# EasyEDA schematic schematic.json
TITLE: Sheet_1; REV: 1.0; Date: 2019-10-06; Sheet: 1/1; Drawn By: saikek; Company: Your Company
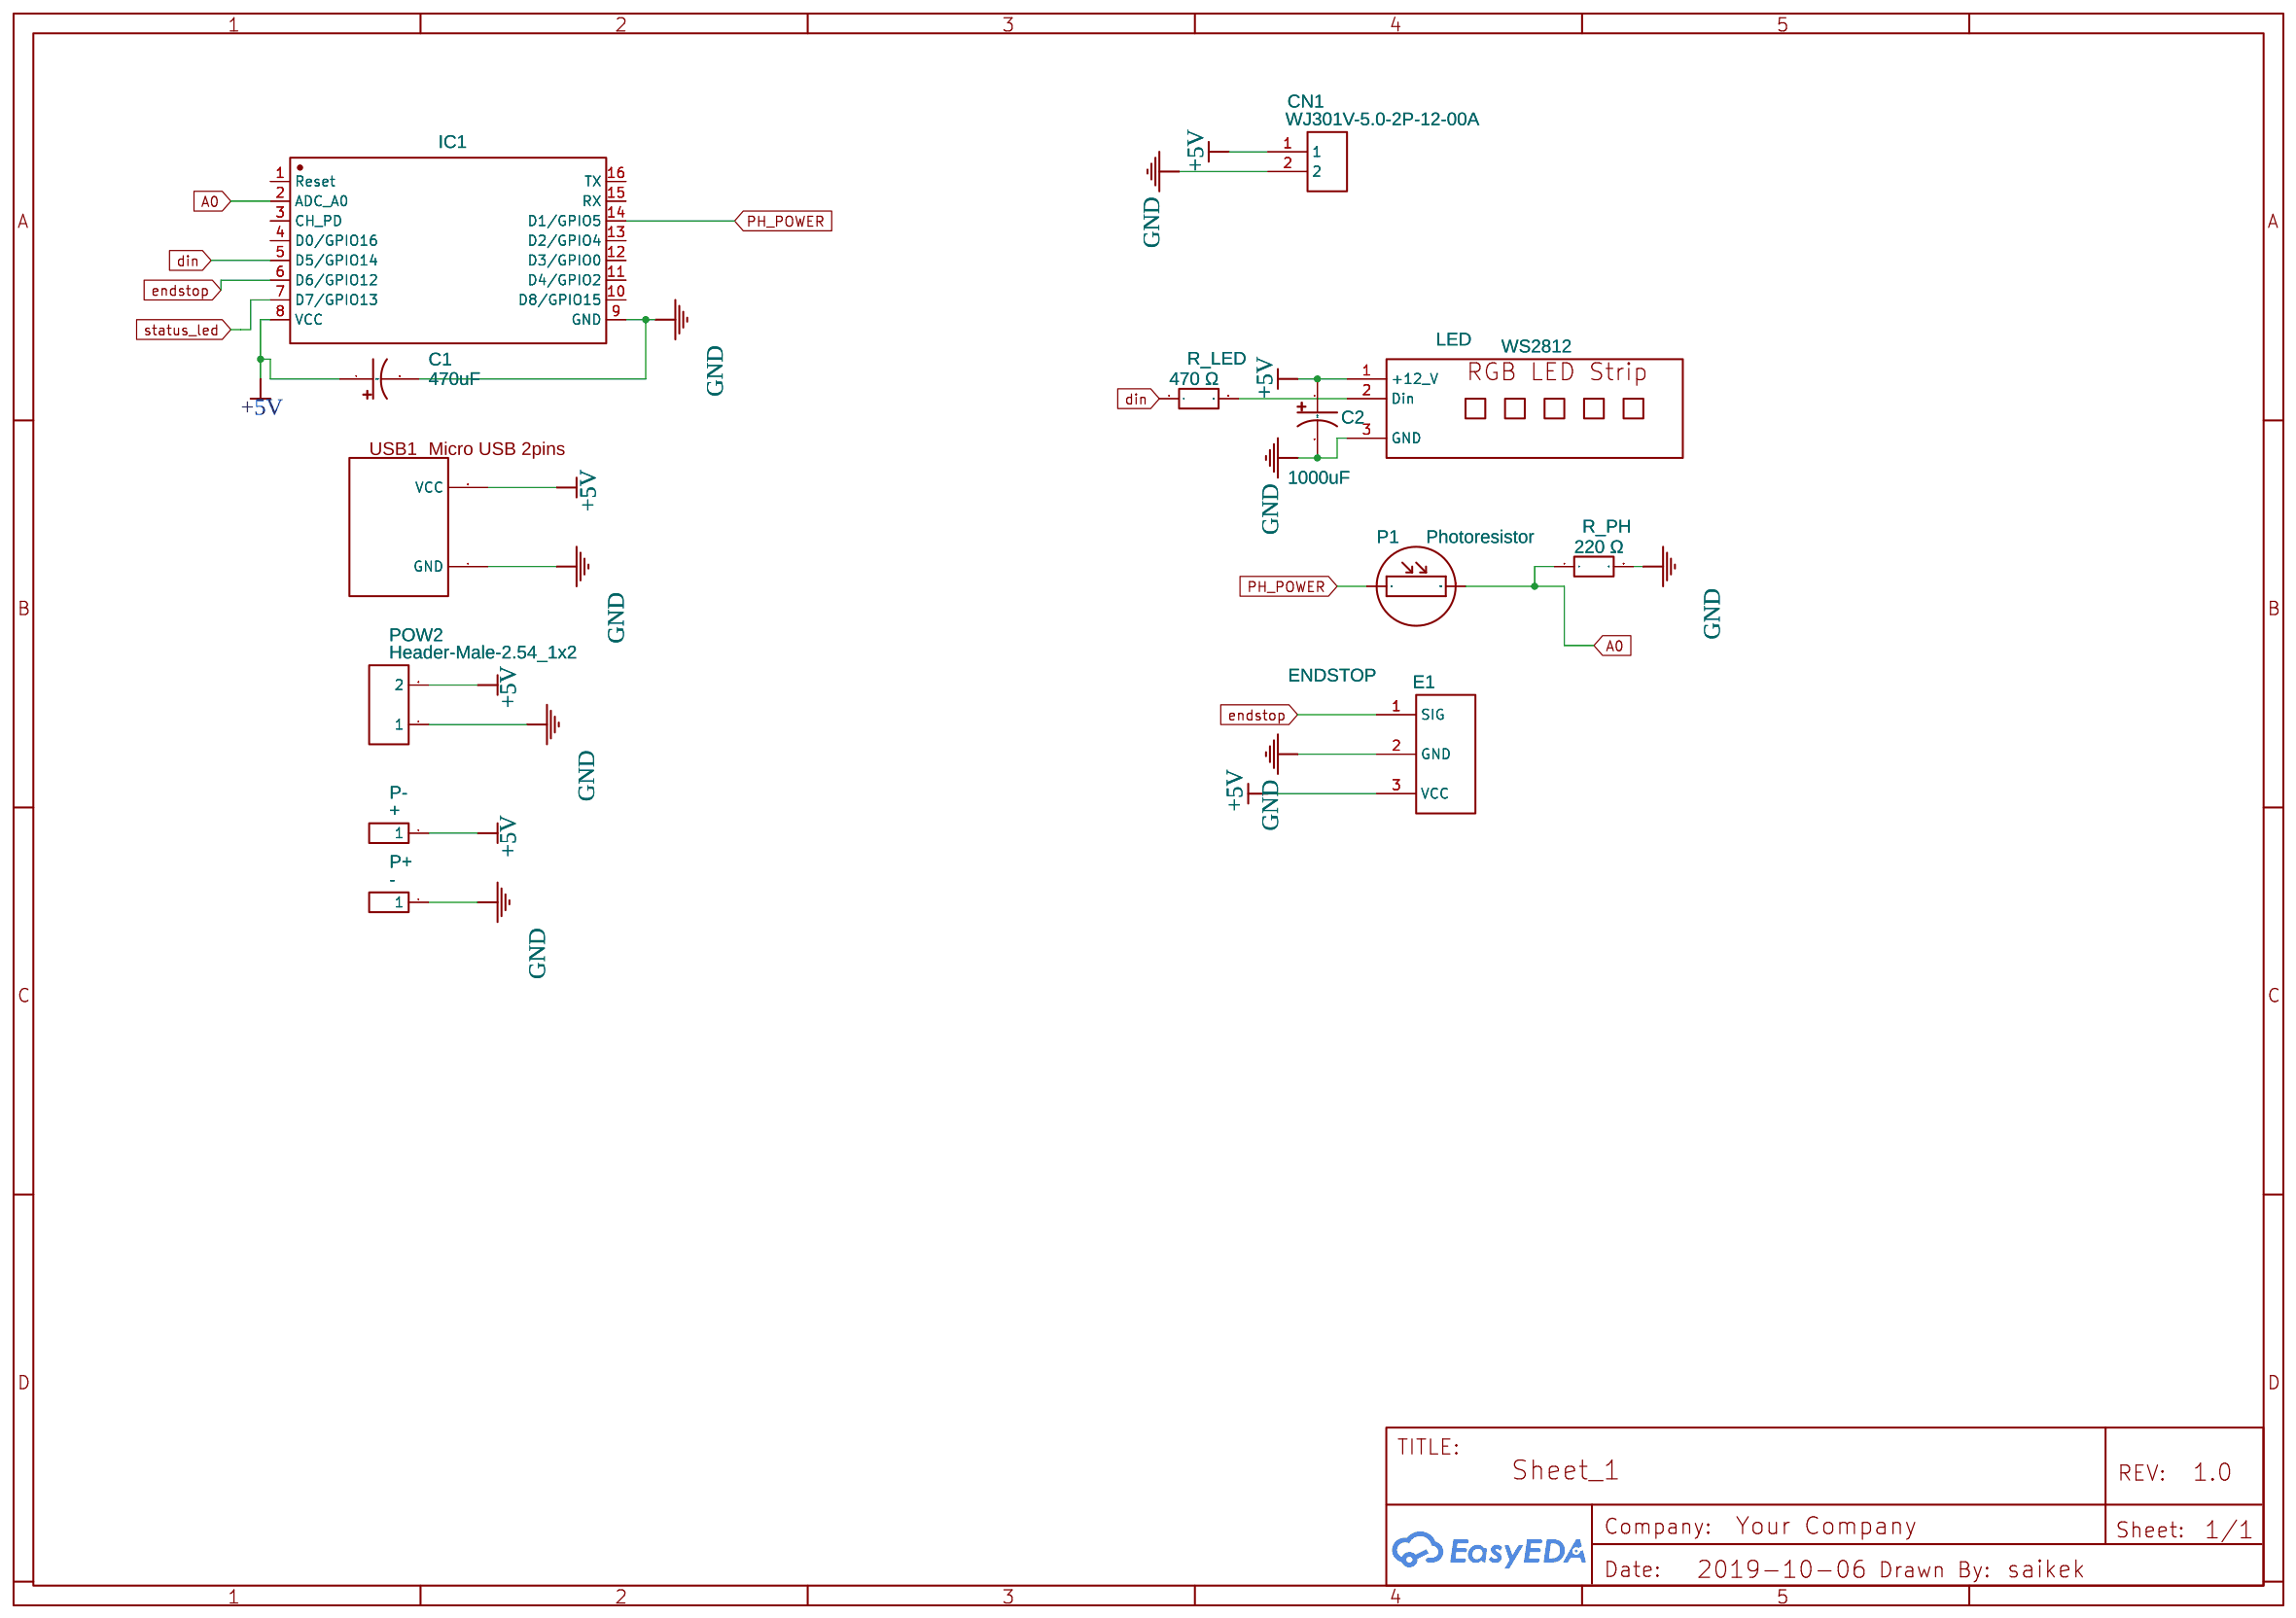
[diagram p0: schematic sheet]

## Parts
C1  470uF  [CAP-SMD_BD6.3-L6.6-W6.6-FD]
C2  1000uF  [CAP-SMD_BD8.0-L8.3-W8.3-FD]
CN1  WJ301V-5.0-2P-12-00A  [WJ301V-5.0-2P-12-00A]
ENDSTOP  E1  [ENDSTOP]
IC1  Witty  [ESP8266_WITTY_12F]
LED  WS2812  [WS2812 LED_STRIP_PADS]
P1  Photoresistor  [SNR2-3.0]
P+  -  [PAD-SMD-R150]
P-  +  [PAD-SMD-R150]
POW2  Header-Male-2.54_1x2  [HDR-2X1/2.54]
R_LED  470 Ω  [1206]
R_PH  220 Ω  [1206]
U2  MicroUSB 2 pins female  [USB 2 PIN FEMALE]

## Library data of the parts
C1 = VE-471M0JTR-0607: Supplier: LCSC; Manufacturer: LELON; Contributor: LCSC; Supplier Part: C134738
C2 = RT0J102M0810: Supplier: LCSC; Supplier Part: C280405; Manufacturer: ROQANG; Contributor: LCSC
CN1 = -: Supplier Part: undefined; Supplier: LCSC; Manufacturer: ReliaPro
ENDSTOP = -: Manufacturer Part: New SchematicLib; Contributor: drwal.mateusz
IC1 = -: Contributor: Victor Produsevich
LED = RGB_LED_Strip_WS2812B: Contributor: dtextor; sourceId: KdNLlHFCA
P1 = -: DIP RES Photoresistor 10K;2P-3.0; Manufacturer Part: Photoresistor-5528
P+ P- = -: Supplier: LCSC; Manufacturer: ReliaPro; Manufacturer Part: Header-Male-2.54_1x1; Supplier Part: C81276
POW2 = -: Supplier: LCSC; Manufacturer: TE Connectivity; Manufacturer Part: 826629-2; image: //image.lceda.cn/szlcsc/C86471.jpg; Supplier Part: C86471
R_LED R_PH = Res_1206(1/4W)_EU
U2 = -: Contributor: CyberneticsCore

## Nets
+5V: C1.1 C2.1 CN1.1 ENDSTOP.3(VCC) IC1.8(VCC) LED.1(+12 V) P-.1 POW2.2 U2.2(VCC)
GND: C1.2 C2.2 CN1.2 ENDSTOP.2(GND) IC1.9(GND) LED.3(GND) P+.1 POW2.1 R_PH.2 U2.1(GND)
A0: IC1.2(ADC_A0) P1.2(P$2) R_PH.1
din: IC1.5(D5/GPIO14) R_LED.1
endstop: ENDSTOP.1(SIG) IC1.6(D6/GPIO12)
PH_POWER: IC1.14(D1/GPIO5) P1.1(P$1)
status_led: IC1.7(D7/GPIO13)
Net-(LED-2): LED.2(Din) R_LED.2

Not connected (* = marked no-connect by the designer): IC1 1(Reset) 3(CH_PD) 4(D0/GPIO16) 10(D8/GPIO15) 11(D4/GPIO2) 12(D3/GPIO0) 13(D2/GPIO4) 15(RX) 16(TX)
